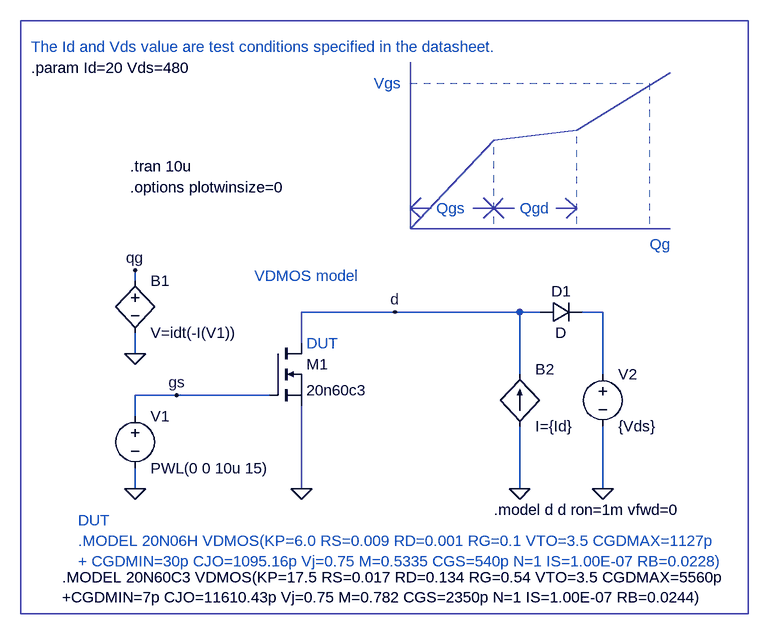
[diagram p0: schematic nmos_model_qg.asc]
nmos_model_qg.asc, the LTspice schematic file:
Version 4
SHEET 1 2828 1468
WIRE 16 368 16 352
WIRE 416 416 272 416
WIRE 608 416 416 416
WIRE 640 416 608 416
WIRE 736 416 704 416
WIRE 272 464 272 416
WIRE 16 480 16 448
WIRE 608 512 608 416
WIRE 736 512 736 416
WIRE 80 544 16 544
WIRE 224 544 80 544
WIRE 16 576 16 544
WIRE 16 688 16 656
WIRE 272 688 272 560
WIRE 608 688 608 592
WIRE 736 688 736 592
FLAG 608 688 0
FLAG 16 688 0
FLAG 272 688 0
FLAG 16 480 0
FLAG 80 544 gs
FLAG 16 352 qg
FLAG 416 416 d
FLAG 736 688 0
SYMBOL voltage 16 560 R0
WINDOW 123 0 0 Left 0
WINDOW 39 0 0 Left 0
SYMATTR InstName V1
SYMATTR Value PWL(0 0 10u 15)
SYMBOL bv 16 352 R0
SYMATTR InstName B1
SYMATTR Value V=idt(-I(V1))
SYMBOL bi 608 592 M180
WINDOW 0 24 88 Left 0
WINDOW 3 24 0 Left 0
SYMATTR InstName B2
SYMATTR Value I={Id}
SYMBOL diode 640 432 R270
WINDOW 0 32 32 VTop 0
WINDOW 3 0 32 VBottom 0
SYMATTR InstName D1
SYMBOL voltage 736 496 R0
WINDOW 123 0 0 Left 0
WINDOW 39 0 0 Left 0
SYMATTR InstName V2
SYMATTR Value {Vds}
SYMBOL nmos 224 464 R0
SYMATTR InstName M1
SYMATTR Value 20n60c3
TEXT 8 192 Left 0 !.tran 10u
TEXT 480 256 Left 0 ;Qgs
TEXT 608 256 Left 0 ;Qgd
TEXT 384 64 Left 0 ;Vgs
TEXT 808 312 Left 0 ;Qg
TEXT 8 224 Left 0 !.options plotwinsize=0
TEXT 200 360 Left 0 ;VDMOS model
TEXT -72 768 Left 0 ;.MODEL 20N06H VDMOS(KP=6.0 RS=0.009 RD=0.001 RG=0.1 VTO=3.5 CGDMAX=1127p \n+ CGDMIN=30p CJO=1095.16p Vj=0.75 M=0.5335 CGS=540p N=1 IS=1.00E-07 RB=0.0228)
TEXT -144 40 Left 0 !.param Id=20 Vds=480
TEXT 568 720 Left 0 !.model d d ron=1m vfwd=0
TEXT -144 8 Left 0 ;The Id and Vds value are test conditions specified in the datasheet.
TEXT 280 464 Left 0 ;DUT
TEXT -72 736 Left 0 ;DUT
TEXT -96 824 Left 0 !.MODEL 20N60C3 VDMOS(KP=17.5 RS=0.017 RD=0.134 RG=0.54 VTO=3.5 CGDMAX=5560p \n+CGDMIN=7p CJO=11610.43p Vj=0.75 M=0.782 CGS=2350p N=1 IS=1.00E-07 RB=0.0244)
LINE Normal 440 288 440 32
LINE Normal 840 288 440 288
LINE Normal 568 152 440 288
LINE Normal 696 136 568 152
LINE Normal 840 48 696 136
LINE Normal 440 64 808 64 2
LINE Normal 808 280 808 64 2
LINE Normal 568 280 568 152 2
LINE Normal 696 280 696 136 2
LINE Normal 600 256 568 256
LINE Normal 696 256 664 256
LINE Normal 472 256 440 256
LINE Normal 582 241 568 256
LINE Normal 584 272 568 256
LINE Normal 678 241 696 256
LINE Normal 680 272 696 256
LINE Normal 456 240 440 256
LINE Normal 456 272 440 256
LINE Normal 536 256 568 256
LINE Normal 552 240 568 256
LINE Normal 552 272 568 256
RECTANGLE Normal 960 880 -160 -32

The netlist it stands for:
* nmos_model_qg.asc
V1 gs 0 PWL(0 0 10u 15)
B1 qg 0 V=idt(-I(V1))
B2 0 d I={Id}
D1 d N001 D
V2 N001 0 {Vds}
M1 d gs 0 0 20n60c3
.model D D
.lib standard.dio
.model NMOS NMOS
.model PMOS PMOS
.lib standard.mos
.tran 10u
* Qgs
* Qgd
* Vgs
* Qg
.options plotwinsize=0
* VDMOS model
* .MODEL 20N06H VDMOS(KP=6.0 RS=0.009 RD=0.001 RG=0.1 VTO=3.5 CGDMAX=1127p
* + CGDMIN=30p CJO=1095.16p Vj=0.75 M=0.5335 CGS=540p N=1 IS=1.00E-07 RB=0.0228)
.param Id=20 Vds=480
.model d d ron=1m vfwd=0
* The Id and Vds value are test conditions specified in the datasheet.
* DUT
* DUT
.MODEL 20N60C3 VDMOS(KP=17.5 RS=0.017 RD=0.134 RG=0.54 VTO=3.5 CGDMAX=5560p
+CGDMIN=7p CJO=11610.43p Vj=0.75 M=0.782 CGS=2350p N=1 IS=1.00E-07 RB=0.0244)
.backanno
.end